# EAGLE design SNES_AddOn1Chip (EAGLE 7.4.0)
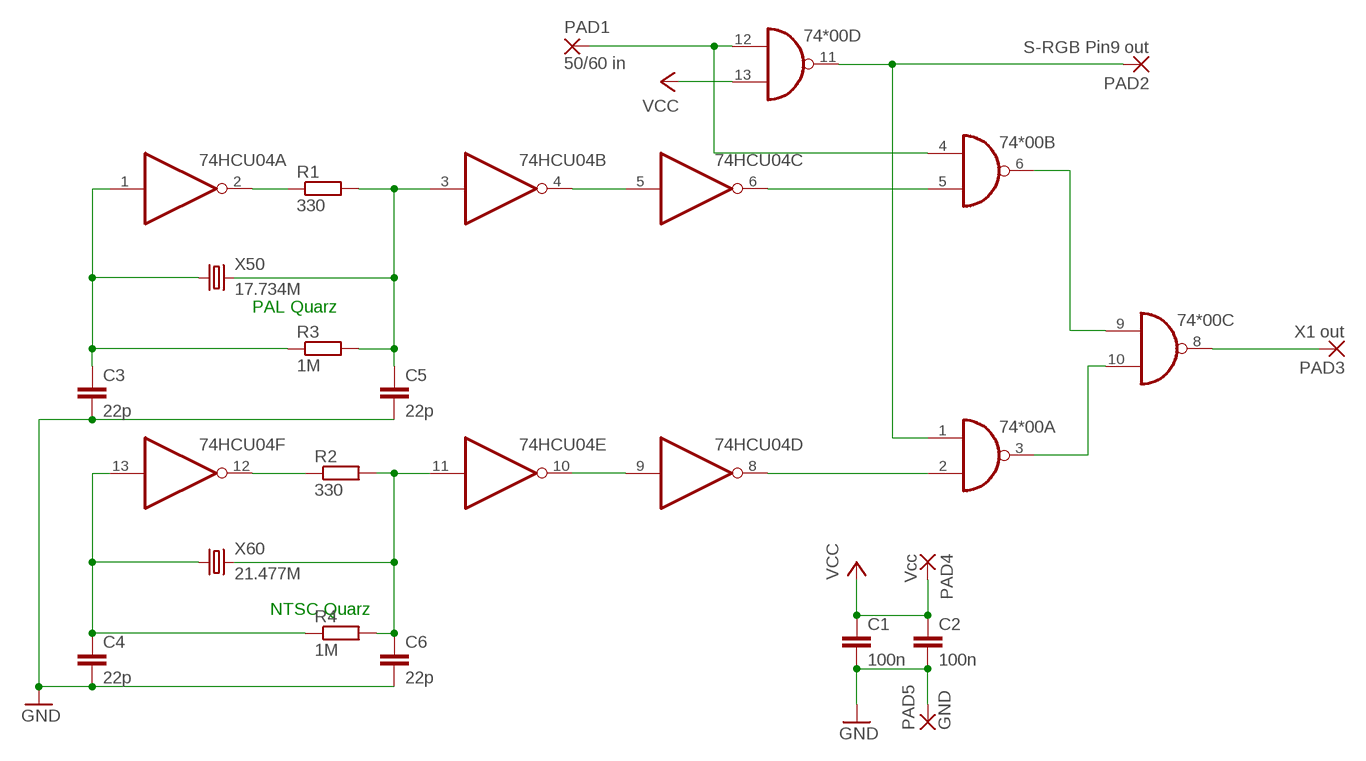
[diagram p0: schematic, sheet 1]

## Parts
74*00  7400D  [SO14]
74HCU04  74HC04D  [SO14]
C1  100n  C0805  [Z0805]
C2  100n  C0805  [Z0805]
C3  22p  C0805  [Z0805]
C4  22p  C0805  [Z0805]
C5  22p  C0805  [Z0805]
C6  22p  C0805  [Z0805]
PAD1  50/60 in  SMD2  [SMD1,27-2,54]
PAD2  S-RGB Pin9 out  SMD2  [SMD1,27-2,54]
PAD3  X1 out  SMD2  [SMD1,27-2,54]
PAD4  Vcc  SMD5  [SMD2,54-5,08]
PAD5  GND  SMD5  [SMD2,54-5,08]
R1  330  R0805  [Z0805]
R2  330  R0805  [Z0805]
R3  1M  R0805  [Z0805]
R4  1M  R0805  [Z0805]
X50  17.734M  MY_CRYSTALS  [MY_SMD_CRYSTAL2]
X60  21.477M  MY_CRYSTALS  [MY_SMD_CRYSTAL2]

## Nets
GND: C1.2 C2.2 C3.2 C4.2 C5.2 C6.2 PAD5.1(P)
N$27: 74HCU04.1(A:I) C3.1 R3.1 X50.1
N$28: 74HCU04.3(B:I) C5.1 R1.2 R3.2 X50.2
N$29: 74HCU04.13(F:I) C4.1 R4.1 X60.1
N$30: 74HCU04.11(E:I) C6.1 R2.2 R4.2 X60.2
N$31: 74*00.3(A:O) 74*00.10(C:I1)
N$32: 74*00.6(B:O) 74*00.9(C:I0)
N$33: 74*00.4(B:I0) 74*00.12(D:I0) PAD1.1(P)
N$35: 74*00.1(A:I0) 74*00.11(D:O) PAD2.1(P)
N$36: 74*00.8(C:O) PAD3.1(P)
N$37: 74HCU04.2(A:O) R1.1
N$38: 74HCU04.4(B:O) 74HCU04.5(C:I)
N$39: 74*00.5(B:I1) 74HCU04.6(C:O)
N$41: 74*00.2(A:I1) 74HCU04.8(D:O)
N$44: 74HCU04.9(D:I) 74HCU04.10(E:O)
N$50: 74HCU04.12(F:O) R2.1
VCC: 74*00.13(D:I1) C1.1 C2.1 PAD4.1(P)

## Notes on the sheet
- PAL Quarz
- NTSC Quarz

## Power pins joined to a net without a drawn wire
GND: 74*00.7(P:GND) 74HCU04.7(P:GND)
VCC: 74*00.14(P:VCC) 74HCU04.14(P:VCC)

## Library data of the parts
74*00 = 74xx-eu:74*00: Quad 2-input NAND gate
74HCU04 = 74xx-eu:74*04: Hex INVERTER
C1-C6 = snescart:C0805
PAD1-PAD3 = wirepad:SMD2: SMD PAD
PAD4 PAD5 = wirepad:SMD5: SMD PAD
R1-R4 = snescart:R0805
X50 X60 = snes_div:MY_CRYSTALS

## Board
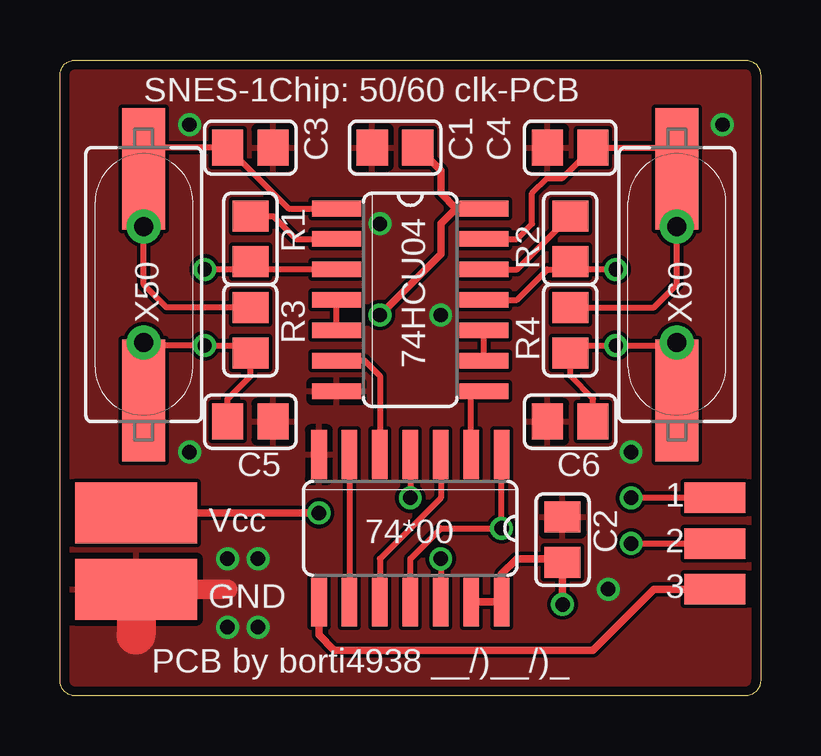
[diagram p1: board, top side]
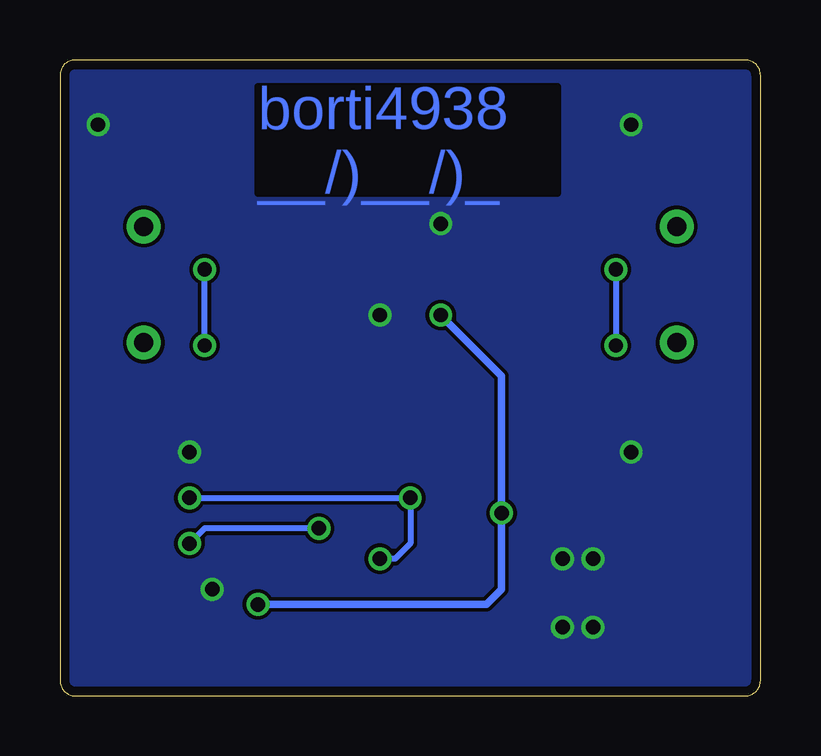
[diagram p2: board, bottom side, seen from below]

Size 29.21 x 26.51 mm. Coordinates in mm from the lower left corner, seen from the top.
Outline: 0.63,0 arc-90 0,0.64 0,25.88 arc-90 0.63,26.51 28.57,26.51 arc-90 29.21,25.88 29.21,0.64 arc-90 28.57,0 0.63,0
Copper layers (1*16): Top 0.0356mm / dielectric 1.5011mm / Bottom 0.0356mm
Design rules "LaenPCBOrder": minimum track width 6mil, minimum drill 13mil, track to track 6mil, track to pad 6mil, pad to pad 6mil, via to via 6mil, smd to smd 6mil, copper to edge 15mil, drill to drill 6mil, minimum pad ring 7mil, minimum via ring 7mil, stop-mask expansion 3mil, vias tented up to drill 30mil, thermal gap 10mil

### Footprints (pad centres in the part's own frame; a part is rotated, then mirrored left to right if it is on the bottom)
SO14 = smd 0.66 x 2.032: 1 -3.81,-3.073; 2 -2.54,-3.073; 3 -1.27,-3.073; 4 0,-3.073; 5 1.27,-3.073; 6 2.54,-3.073; 7 3.81,-3.073; 8 3.81,3.073; 9 2.54,3.073; 10 1.27,3.073; 11 0,3.073; 12 -1.27,3.073; 13 -2.54,3.073; 14 -3.81,3.073
Z0805 = smd 1.3 x 1.5: 1 -0.95,0; 2 0.95,0
SMD1,27-2,54 = smd 1.27 x 2.54: 1 0,0
SMD2,54-5,08 = smd 2.54 x 5.08: 1 0,0
MY_SMD_CRYSTAL2 = smd 5.08 x 1.778: 1 -4.826,0; 2 4.826,0

### Placement (x,y rotation side)
74*00  14.61,6.98 180 top
74HCU04  14.61,16.51 270 top
C1  13.97,22.86 180 top
C2  20.96,6.51 90 top
C3  7.94,22.86 0 top
C4  21.27,22.86 180 top
C5  7.94,11.43 0 top
C6  21.27,11.43 180 top
PAD1  27.3,8.26 90 top
PAD2  27.3,6.35 90 top
PAD3  27.3,4.45 90 top
PAD4  3.18,7.62 90 top
PAD5  3.18,4.45 90 top
R1  7.94,19.05 270 top
R2  21.27,19.05 270 top
R3  7.94,15.24 270 top
R4  21.27,15.24 270 top
X50  3.49,17.15 270 top
X60  25.72,17.15 270 top

### Tracks (layer width: path | path; a pad name or v marks a point on that pad's centre or on a via)
GND  (via drill 0.6)
  Top 0.813: 6.98,4.45 PAD5.1
  Top 1.626: PAD5.1 3.18,2.54
  other vias: 6.98,2.86 15.88,15.88 13.34,19.69 27.62,23.81 5.4,10.16 23.81,10.16 22.86,4.45 5.4,23.81 6.98,5.71 8.25,2.86 8.25,5.71
  pour Top: -1.91,-0.63 31.11,-0.63 31.11,27.3 -1.91,27.3
  pour Bottom: -1.91,-0.63 31.11,-0.63 31.11,27.3 -1.91,27.3
N$27  (via drill 0.8 pad 1.42)
  Top 0.254: R3.1 4.45,16.19 3.49,17.15 v3.49,19.56 X50.1 3.49,22.23 4.13,22.86 C3.1 9.52,20.32 74HCU04.1
N$28  (via drill 0.6, 0.8 pad 1.42)
  Top 0.254: 74HCU04.3 8.26,17.78 | 8.26,17.78 R1.2 | 8.26,17.78 v6.03,17.78 | C5.1 6.99,12.39 7.94,13.34 R3.2 7.62,14.61 v6.03,14.61 3.49,14.61 v3.49,14.73 X50.2
  Bottom 0.254: v6.03,17.78 v6.03,14.61
N$29  (via drill 0.8 pad 1.42)
  Top 0.254: R4.1 24.76,16.19 25.72,17.15 v25.72,19.56 X60.1 25.72,22.23 25.08,22.86 C4.1 20.95,21.59 20.32,21.59 19.68,20.95 19.68,19.69 19.05,19.05 74HCU04.13
N$30  (via drill 0.6, 0.8 pad 1.42)
  Top 0.254: R2.2 21.27,17.78 20.96,17.78 | v23.18,17.78 21.59,17.78 R2.2 | C6.1 22.22,12.39 21.27,13.34 R4.2 21.27,14.61 v23.18,14.61 25.72,14.61 v25.72,14.73 X60.2 | 74HCU04.11 19.05,16.51 20.32,17.78 20.95,17.78 R2.2
  Bottom 0.254: v23.18,14.61 v23.18,17.78
N$31
  Top 0.254: 74*00.3 15.88,8.26 13.34,5.71 74*00.10
N$32
  Top 0.254: 74*00.6 74*00.9
N$33  (via drill 0.6)
  Top 0.254: 74*00.4 v14.61,8.26 | PAD1.1 v23.81,8.26 | v15.88,5.71 74*00.12
  Bottom 0.254: v15.88,5.71 15.24,5.71 14.61,6.35 v14.61,8.26 v23.81,8.26
N$35  (via drill 0.6)
  Top 0.254: 74*00.11 14.61,5.71 15.88,6.98 v18.42,6.98 74*00.1 | v23.81,6.35 PAD2.1
  Bottom 0.254: v18.42,6.98 23.18,6.98 v23.81,6.35
N$36
  Top 0.305: PAD3.1 24.76,4.45 22.22,1.91 11.43,1.91 10.79,2.54 74*00.8
N$37
  Top 0.254: R1.1 8.89,20 9.84,19.05 74HCU04.2
N$38
  Top 0.254: 74HCU04.5 74HCU04.4
N$39
  Top 0.254: 74HCU04.6 12.7,13.97 13.34,13.34 74*00.5
N$41
  Top 0.254: 74*00.2 17.14,12.7 74HCU04.8
N$44
  Top 0.254: 74HCU04.9 74HCU04.10
N$50
  Top 0.254: 74HCU04.12 19.05,17.78 R2.1
VCC  (via drill 0.6)
  Top 0.305: 74*00.13 74*00.14 18.42,5.08 19.05,5.71 20.64,5.71 C2.1 v20.96,3.81 | PAD4.1 v10.79,7.62 | C1.1 15.88,21.91 15.88,20.95 16.51,20.32 | 16.51,20.32 15.88,19.69 15.88,18.41 v13.34,15.88 | 74HCU04.14 16.51,20.32
  Bottom 0.305: v20.96,3.81 11.43,3.81 10.79,4.45 v10.79,7.62 10.79,13.34 v13.34,15.88

### Text on the board
Bottom: borti4938 / __/)__/)_
tNames: SNES-1Chip: 50/60 clk-PCB | C3 | C1 | C4 | R1 | R2 | R3 | X50 | X60 | 74HCU04 | R4 | C5 | C6 | 1 | C2 | Vcc | 74*00 | 2 | 3 | GND | PCB by borti4938 __/)__/)_